# EAGLE design BaseModule (EAGLE 9.6.2)
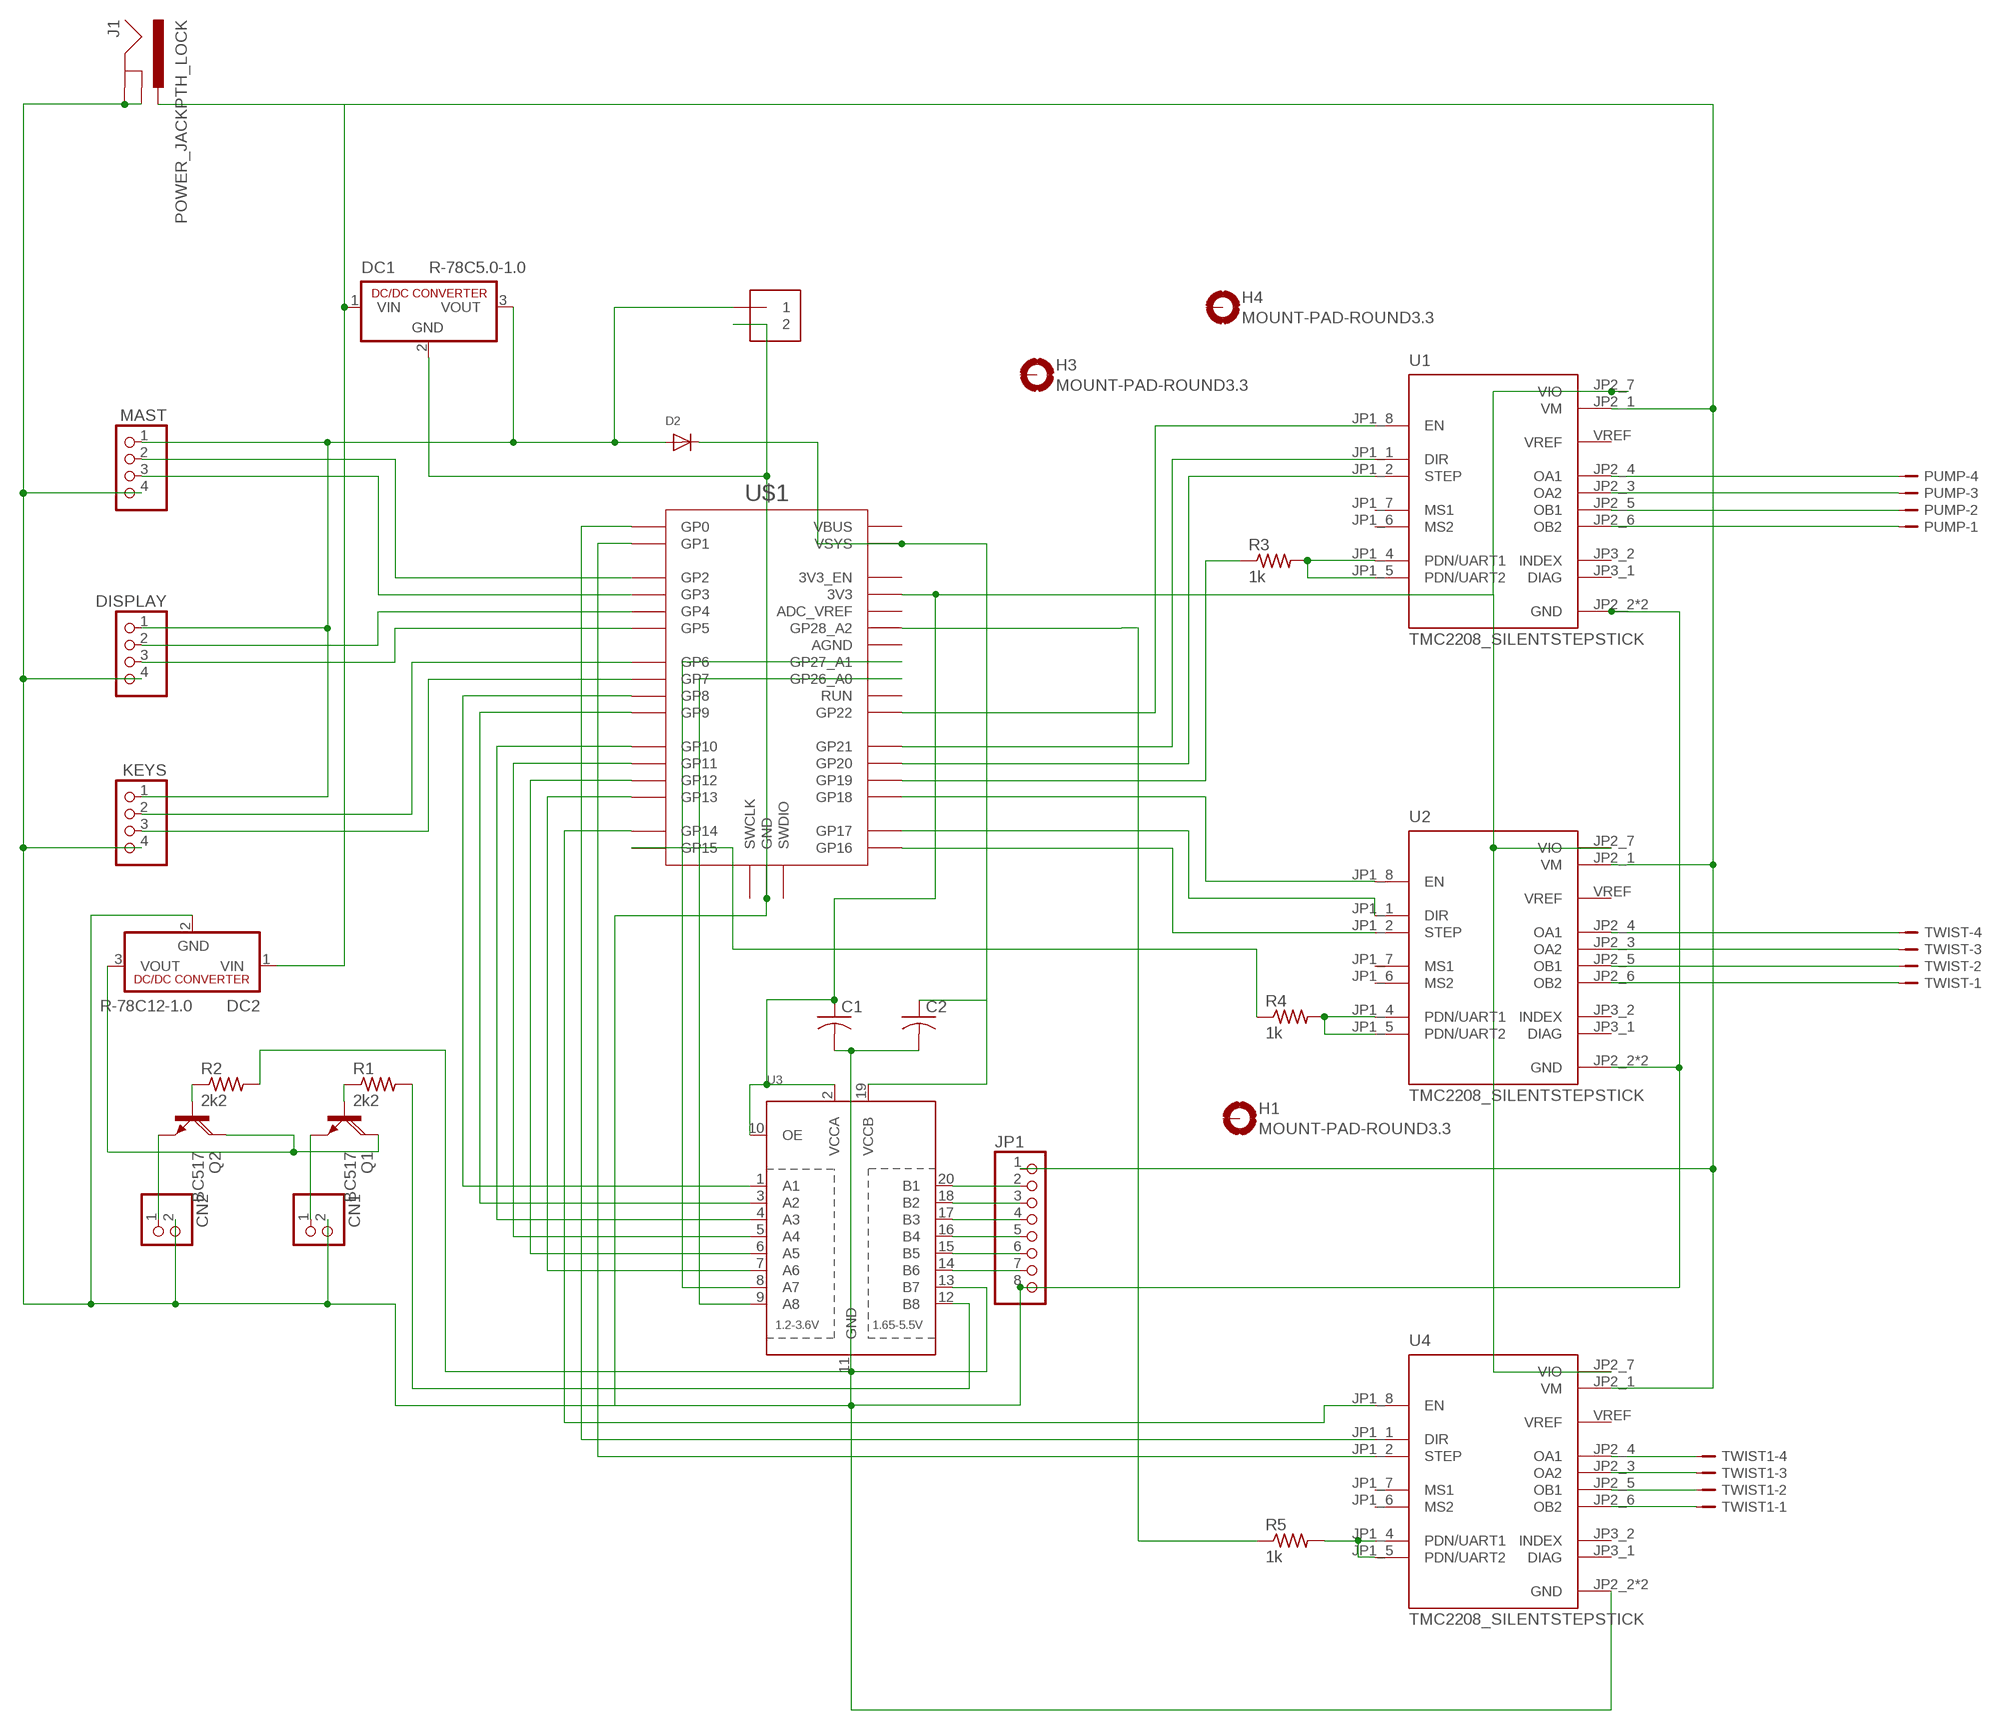
[diagram p0: schematic, sheet 1]

## Parts
C1  C-USC1206  [C1206]
C2  C-USC1206  [C1206]
CN1  JST_2PIN-THM-RA  [JST-PH-2-THM-RA]
CN2  JST_2PIN-THM-RA  [JST-PH-2-THM-RA]
D2  DIODESMA  [SMADIODE]
DC1  R-78C5.0-1.0  [SIP3]
DC2  R-78C12-1.0  [SIP3]
DISPLAY  PINHD-1X4  [1X04]
H1  MOUNT-PAD-ROUND3.3  [3,3-PAD]
H3  MOUNT-PAD-ROUND3.3  [3,3-PAD]
H4  MOUNT-PAD-ROUND3.3  [3,3-PAD]
J1  POWER_JACKPTH_LOCK  [POWER_JACK_PTH_LOCK]
J2  1X2-3.5MM  [1X2-3.5MM]
JP1  PINHD-1X8-3.5MM  [1X08-3.5MM]
KEYS  PINHD-1X4  [1X04]
MAST  PINHD-1X4  [1X04]
PUMP  JST-PH-4_TH-RA  [S4B-PH-KL]
Q1  BC517  [SOT54A]
Q2  BC517  [SOT54A]
R1  2k2  R-US_R1206  [R1206]
R2  2k2  R-US_R1206  [R1206]
R3  1k  R-US_R1206  [R1206]
R4  1k  R-US_R1206  [R1206]
R5  1k  R-US_R1206  [R1206]
TWIST  JST-PH-4_TH-RA  [S4B-PH-KL]
TWIST1  JST-PH-4_TH-RA  [S4B-PH-KL]
U1  TMC2208_SILENTSTEPSTICK  [MODULE_TMC2208_SILENTSTEPSTICK]
U2  TMC2208_SILENTSTEPSTICK  [MODULE_TMC2208_SILENTSTEPSTICK]
U3  TXB0108PWR  [TSSOP20]
U4  TMC2208_SILENTSTEPSTICK  [MODULE_TMC2208_SILENTSTEPSTICK]
U$1  RPI_PICO-TH  [RPI_PICO_TH]

## Nets
GND: C1.2 C2.2 CN1.2 CN2.2 DC1.2(GND) DC2.2(GND) DISPLAY.4 J1.GND J1.GNDBREAK J2.2 JP1.8 KEYS.4 MAST.4 U1.JP2_2(GND) U1.JP2_8(GND) U2.JP2_2(GND) U2.JP2_8(GND) U3.11(GND) U4.JP2_2(GND) U4.JP2_8(GND) U$1.GND@1(GND) U$1.GND@2(GND) U$1.GND@3(GND) U$1.GND@4(GND) U$1.GND@5(GND) U$1.GND@6(GND) U$1.GND@7(GND) U$1.GND@8(GND)
N$1: Q1.B R1.1
N$2: Q2.B R2.1
N$3: R3.2 U1.JP1_4(PDN/UART1) U1.JP1_5(PDN/UART2)
N$4: R4.2 U2.JP1_4(PDN/UART1) U2.JP1_5(PDN/UART2)
N$5: DC1.1(VIN) DC2.1(VIN) J1.PWR JP1.1 U1.JP2_1(VM) U2.JP2_1(VM) U4.JP2_1(VM)
N$6: U2.JP1_8(EN) U$1.GP18
N$7: TWIST1.4 U4.JP2_4(OA1)
N$8: C2.1 D2.C U3.19(VCCB) U$1.VSYS
N$9: U3.7(A6) U$1.GP13
N$10: CN2.1 Q2.E
N$11: JP1.2 U3.20(B1)
N$12: R4.1 U$1.GP15
N$13: D2.A DC1.3(VOUT) DISPLAY.1 J2.1 KEYS.1 MAST.1
N$14: TWIST1.3 U4.JP2_3(OA2)
N$15: TWIST.4 U2.JP2_4(OA1)
N$16: TWIST.3 U2.JP2_3(OA2)
N$17: TWIST.2 U2.JP2_5(OB1)
N$18: TWIST.1 U2.JP2_6(OB2)
N$19: PUMP.4 U1.JP2_4(OA1)
N$20: PUMP.3 U1.JP2_3(OA2)
N$21: PUMP.2 U1.JP2_5(OB1)
N$22: PUMP.1 U1.JP2_6(OB2)
N$23: U2.JP1_1(DIR) U$1.GP17
N$24: U2.JP1_2(STEP) U$1.GP16
N$25: JP1.3 U3.18(B2)
N$26: U1.JP1_8(EN) U$1.GP22
N$27: U1.JP1_1(DIR) U$1.GP21
N$28: U1.JP1_2(STEP) U$1.GP20
N$29: R3.1 U$1.GP19
N$30: MAST.2 U$1.GP2
N$31: MAST.3 U$1.GP3
N$32: DISPLAY.2 U$1.GP4
N$33: DISPLAY.3 U$1.GP5
N$34: KEYS.2 U$1.GP6
N$35: KEYS.3 U$1.GP7
N$36: CN1.1 Q1.E
N$37: JP1.4 U3.17(B3)
N$38: JP1.5 U3.16(B4)
N$39: JP1.6 U3.15(B5)
N$40: JP1.7 U3.14(B6)
N$41: U3.1(A1) U$1.GP8
N$42: TWIST1.2 U4.JP2_5(OB1)
N$43: C1.1 U1.JP2_7(VIO) U2.JP2_7(VIO) U3.2(VCCA) U3.10(OE) U4.JP2_7(VIO) U$1.3V3
N$44: R2.2 U3.13(B7)
N$45: R1.2 U3.12(B8)
N$46: U3.3(A2) U$1.GP9
N$47: U3.4(A3) U$1.GP10
N$48: U3.5(A4) U$1.GP11
N$49: U3.6(A5) U$1.GP12
N$50: DC2.3(VOUT) Q1.C Q2.C
N$51: U3.8(A7) U$1.GP27_A1
N$52: U3.9(A8) U$1.GP26_A0
N$53: TWIST1.1 U4.JP2_6(OB2)
N$54: U4.JP1_8(EN) U$1.GP14
N$55: R5.1 U$1.GP28_A2
N$56: R5.2 U4.JP1_4(PDN/UART1) U4.JP1_5(PDN/UART2)
N$57: U4.JP1_1(DIR) U$1.GP0
N$58: U4.JP1_2(STEP) U$1.GP1
Unconnected: H1.B3,3(MOUNT) H3.B3,3(MOUNT) H4.B3,3(MOUNT) U1.JP1_6(MS2) U1.JP1_7(MS1) U1.JP3_1(DIAG) U1.JP3_2(INDEX) U1.VREF U2.JP1_6(MS2) U2.JP1_7(MS1) U2.JP3_1(DIAG) U2.JP3_2(INDEX) U2.VREF U4.JP1_6(MS2) U4.JP1_7(MS1) U4.JP3_1(DIAG) U4.JP3_2(INDEX) U4.VREF U$1.3V3_EN U$1.ADC_VREF U$1.AGND U$1.RUN U$1.SWCLK U$1.SWDIO U$1.VBUS

## Library data of the parts
C1 C2 = adafruit:C-US: CAPACITOR, American symbol
CN1 CN2 = adafruit:JST_2PIN: JST 2-Pin Connectors of various flavors SMT-RA (S2B-PH-SM4) 4UConnector #17311 SMT (B2B-PH-SM4) THM-RA (S2B-PH) THM (B2B-PH)
D2 = adafruit:DIODE: Diode SMADIODE - SMA Surface Mount Package 20V 1A Schottky Diode Digikey: 641-1014-6-ND DO-1N4148 - Through Hole Small Current Diode SOD-123 20V 1 A (.5mV Vf) Schottky Diode - Digikey: MBRX120TPMSCT-ND SOD-323 10V 570mA (.38mV Vf, 3ns) Schottky Diode - Digikey: ZLLS410CT-ND SOD-523 30V 30mA Schottky Diode (RB751S-40TE61) - Digikey: RB751S-40TE61CT-ND SOT23-R/W - SOT23 Package (R = Solder Paste/Reflow Ovens, W = Hand-Soldering) BAT54Film 40V 300mA - Digikey: 497-7162-1-ND
DC1 DC2 = dc-dc-converter:R-78C*-1.0: INNOLINE DC/DC-Converter 1.0 AMP SIP3 Single Output Source: Data sheet <http://www.mikrocontroller.net/attachment/150645/157764-da-01-en-DC_DC_WANDLER_R_78C5_0_1_0.pdf>
DISPLAY KEYS MAST = pinhead:PINHD-1X4: PIN HEADER
H1 H3 H4 = holes:MOUNT-PAD-ROUND: MOUNTING PAD, round
J1 = SparkFun-Connectors:POWER_JACK: Power Jack Connector This is the standard 5.5mm barrel jack for power. The PTH is the most common, proven, reliable, footprint. The Slot footprint only works if the mill layer is transmitted to the PCB fab house so be warned. Here are the connectors we sell at SparkFun: DC Barrel Power Jack/Connector <https://www.sparkfun.com/products/119> (PRT-00119) DC Barrel Power Jack/Connector (SMD) <https://www.sparkfun.com/products/12748> (PRT-12748) DC Barrel Jack Adapter - Breadboard Compatible <https://www.sparkfun.com/products/10811> (PRT-10811) It is used on this SparkFun product (and many, many others): SparkFun RedBoard - Programmed with Arduino <https://www.sparkfun.com/products/12757> (DEV-12757) Also, if you need a mating power supply or connector, please check these out: Wall Adapter Power Supply - 9VDC 650mA <https://www.sparkfun.com/products/298> (TOL-00298) DC Barrel Jack Adapter - Male <https://www.sparkfun.com/products/10287> (PRT-10287); PROD_ID: CONN-08197; SF_ID: PRT-00119
J2 = adafruit:1X2: 3.5mm Terminal block http://www.ladyada.net/library/pcb/eaglelibrary.html
JP1 = adafruit:PINHD-1X8: PIN HEADER
PUMP TWIST TWIST1 = con-JST-PH:JST-PH-4; MF: JST; MPN: S4B-PH-KL
Q1 Q2 = transistor-small-signal:BC517: NPN DARLINGTON TRANSISTOR
R1-R5 = adafruit:R-US_: RESISTOR, American symbol
U1 U2 U4 = TMC2208_SILENTSTEPSTICK:TMC2208_SILENTSTEPSTICK: Check availability <https://pricing.snapeda.com/parts/TMC2208%20SILENTSTEPSTICK/Trinamic%20Motion/view-part?ref=eda>; AVAILABILITY: In Stock; CHECK_PRICES: https://www.snapeda.com/parts/TMC2208%20SILENTSTEPSTICK/Trinamic/view-part/?ref=eda; DESCRIPTION: TMC2208 Motor Controller/Driver, Stepper Power Management Evaluation Board; MF: Trinamic Motion; MP: TMC2208 SILENTSTEPSTICK; PACKAGE: None; PRICE: None; SNAPEDA_LINK: https://www.snapeda.com/parts/TMC2208%20SILENTSTEPSTICK/Trinamic/view-part/?ref=snap
U3 = adafruit:TXB0108PWR: 8-Bit Bi-Directional Level Shifter 1.2V-3.6V (VCCA) to 1.65V-5.5V (VCCB) bi-directional level shifter with auto direction sensing. Max data rate - VCCA 1.8V: 20Mbps (50ns), VCCA 3.3V: 100Mbps (10ns) Digikey: 296-21527-1-ND
U$1 = RaspberryPi_Pico:RPI_PICO

## Board
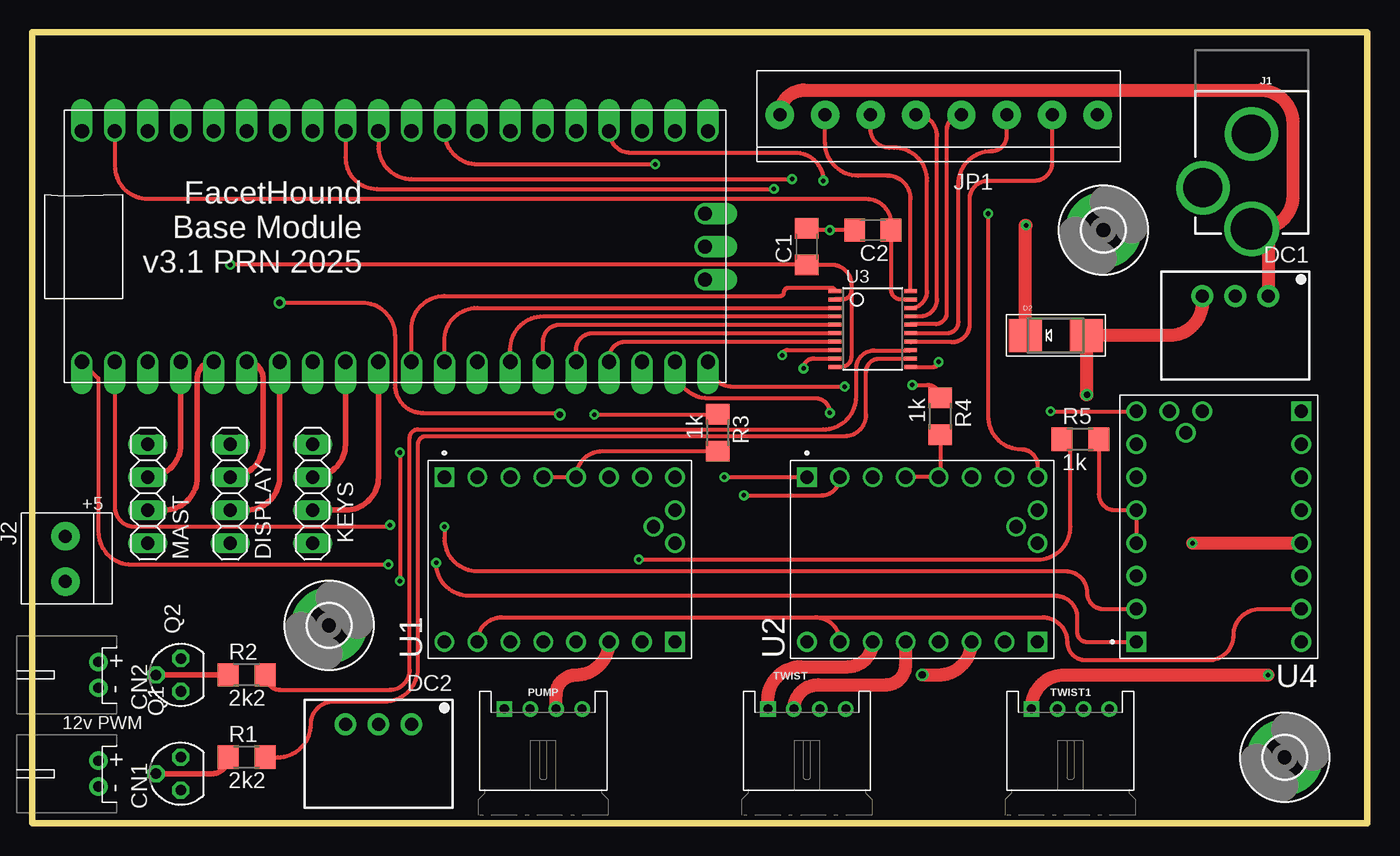
[diagram p1: board, top side]
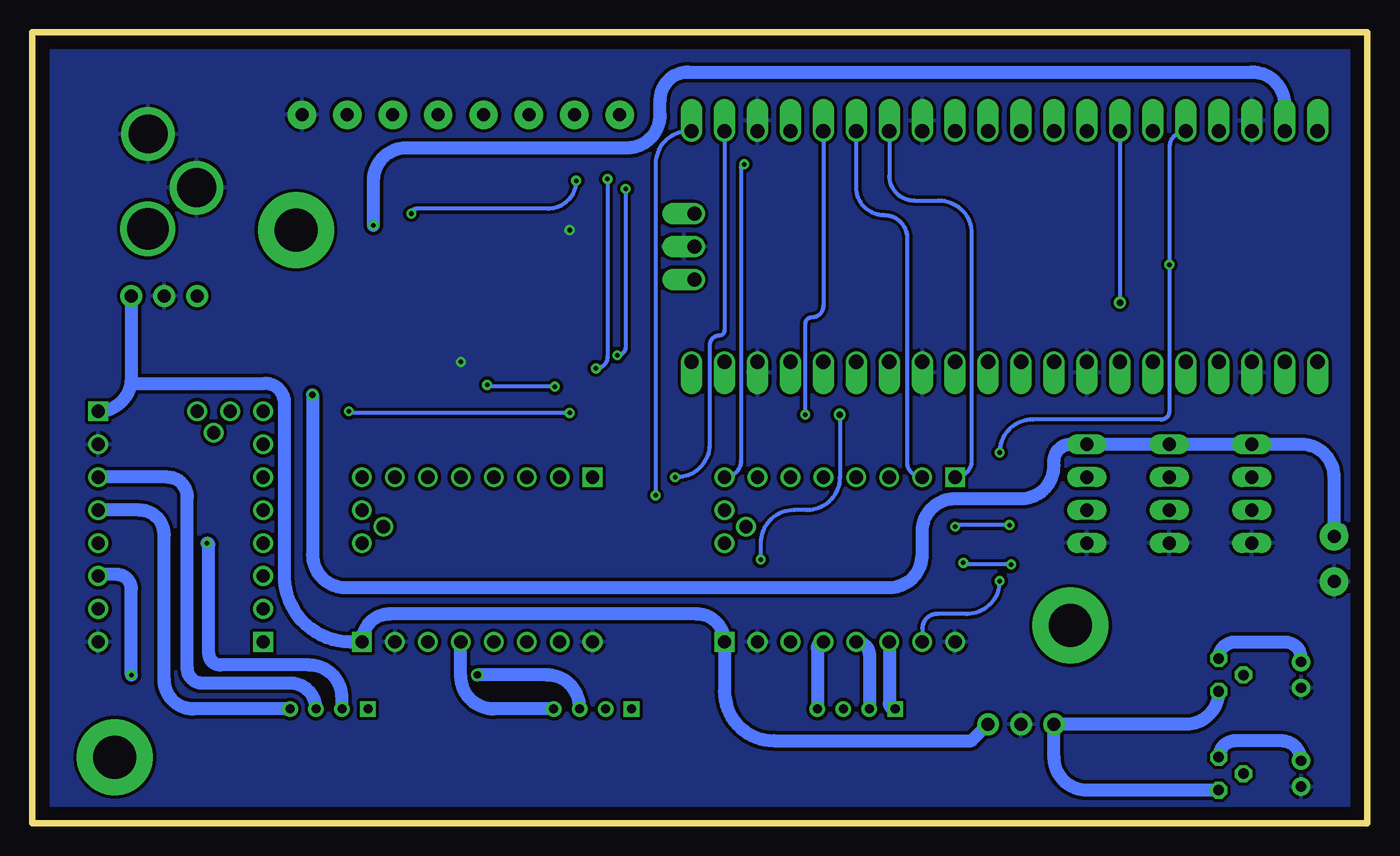
[diagram p2: board, bottom side, seen from below]

Size 102.87 x 60.96 mm. Coordinates in mm from the lower left corner, seen from the top.
Outline: 0,0 0,60.96 102.87,60.96 102.87,0 0,0
Copper layers (1*16): Top 0.035mm / dielectric 1.5mm / Bottom 0.035mm
Design rules "default": minimum track width 6mil, minimum drill 0.35mm, track to track 6mil, track to pad 6mil, pad to pad 6mil, via to via 6mil, smd to smd 6mil, copper to edge 40mil, drill to drill 6mil, minimum pad ring 10mil, minimum via ring 8mil, stop-mask expansion 4mil, vias tented up to drill 0mil, thermal gap 10mil

### Footprints (pad centres in the part's own frame; a part is rotated, then mirrored left to right if it is on the bottom)
C1206 = smd 1.6 x 1.8: 1 -1.4,0; 2 1.4,0
JST-PH-2-THM-RA = drill 0.8 pad 1.422: 1 1,0; 2 -1,0
SMADIODE = smd 2.54 x 2.54: A 2.349,0; C -2.349,0
SIP3 = drill 1 pad 1.676: 1 -2.54,0; 2 0,0; 3 2.54,0
1X04 = drill 1.016 long: 1 -3.81,0; 2 -1.27,0; 3 1.27,0; 4 3.81,0
3,3-PAD = drill 3.3 pad 5.842: B3,3 0,0
POWER_JACK_PTH_LOCK = drill 2.997 pad 4.115: GND 0.025,6.557; GNDBREAK 3.762,10.7 | drill 3.2 pad 4.115: PWR 0,13.878
1X2-3.5MM = drill 1 pad 2.184: 1 1.8,0; 2 -1.7,0
1X08-3.5MM = drill 1 pad 2.184: 1 -12.25,0; 2 -8.75,0; 3 -5.25,0; 4 -1.75,0; 5 1.75,0; 6 5.25,0; 7 8.75,0; 8 12.25,0
S4B-PH-KL = drill 0.7 square: 1 3,-3.72 | drill 0.7: 2 1,-3.72; 3 -1,-3.72; 4 -3,-3.72
SOT54A = drill 0.813 octagon: B 0,1.905; C -1.27,0; E 1.27,0
R1206 = smd 1.6 x 1.803: 1 -1.422,0; 2 1.422,0
MODULE_TMC2208_SILENTSTEPSTICK = drill 1.016 square: JP1_1 6.35,8.89; JP2_1 -6.35,-8.89 | drill 1.016: JP1_2 6.35,6.35; JP1_3 6.35,3.81; JP1_4 6.35,1.27; JP1_5 6.35,-1.27; JP1_6 6.35,-3.81; JP1_7 6.35,-6.35; JP1_8 6.35,-8.89; JP2_2 -6.35,-6.35; JP2_3 -6.35,-3.81; JP2_4 -6.35,-1.27; JP2_5 -6.35,1.27; JP2_6 -6.35,3.81; JP2_7 -6.35,6.35; JP2_8 -6.35,8.89; JP3_1 1.27,-8.89; JP3_2 3.81,-8.89; VREF 2.54,-7.239
TSSOP20 = smd 0.305 x 0.991: 1 -2.925,-2.918; 2 -2.275,-2.918; 3 -1.625,-2.918; 4 -0.975,-2.918; 5 -0.325,-2.918; 6 0.325,-2.918; 7 0.975,-2.918; 8 1.625,-2.918; 9 2.275,-2.918; 10 2.925,-2.918; 11 2.925,2.918; 12 2.275,2.918; 13 1.625,2.918; 14 0.975,2.918; 15 0.325,2.918; 16 -0.325,2.918; 17 -0.975,2.918; 18 -1.625,2.918; 19 -2.275,2.918; 20 -2.925,2.918
RPI_PICO_TH = drill 1.1 pad 1.6 offset: 3V3 8.89,13.97; 3V3_EN 8.89,16.51; ADC_VREF 8.89,11.43; AGND 8.89,6.35; GND@1 -8.89,19.05; GND@2 -8.89,6.35; GND@3 -8.89,-6.35; GND@4 -8.89,-19.05; GND@5 0,-23.9; GND@6 8.89,-19.05; GND@7 8.89,-6.35; GND@8 8.89,19.05; GP0 -8.89,24.13; GP1 -8.89,21.59; GP2 -8.89,16.51; GP3 -8.89,13.97; GP4 -8.89,11.43; GP5 -8.89,8.89; GP6 -8.89,3.81; GP7 -8.89,1.27; GP8 -8.89,-1.27; GP9 -8.89,-3.81; GP10 -8.89,-8.89; GP11 -8.89,-11.43; GP12 -8.89,-13.97; GP13 -8.89,-16.51; GP14 -8.89,-21.59; GP15 -8.89,-24.13; GP16 8.89,-24.13; GP17 8.89,-21.59; GP18 8.89,-16.51; GP19 8.89,-13.97; GP20 8.89,-11.43; GP21 8.89,-8.89; GP22 8.89,-3.81; GP26_A0 8.89,1.27; GP27_A1 8.89,3.81; GP28_A2 8.89,8.89; RUN 8.89,-1.27; SWCLK -2.54,-23.9; SWDIO 2.54,-23.9; VBUS 8.89,24.13; VSYS 8.89,21.59

### Placement (x,y rotation side)
C1  59.69,44.45 90 top
C2  64.77,45.72 180 top
CN1  5.08,3.81 90 top
CN2  5.08,11.43 90 top
D2  78.87,37.59 0 top
DC1  92.71,40.64 180 top
DC2  26.67,7.62 180 top
DISPLAY  15.24,25.4 270 top
H1  82.55,45.72 0 top
H3  96.52,5.08 0 top
H4  22.86,15.24 0 top
J1  93.98,59.69 180 top
J2  2.54,20.32 90 top
JP1  69.85,54.61 0 top
KEYS  21.59,25.4 270 top
MAST  8.89,25.4 270 top
PUMP  39.37,5.08 180 top
Q1  11.43,3.81 90 top
Q2  11.43,11.43 90 top
R1  16.51,5.08 0 top
R2  16.51,11.43 0 top
R3  52.83,30.1 270 top
R4  69.98,31.37 270 top
R5  80.77,29.59 0 top
TWIST  59.69,5.08 180 top
TWIST1  80.01,5.08 180 top
U1  40.64,20.32 90 top
U2  68.58,20.32 90 top
U3  64.77,38.1 270 top
U4  91.44,22.86 180 top
U$1  27.94,44.45 90 top

### Tracks (layer width: path | path; a pad name or v marks a point on that pad's centre or on a via)
GND  (via drill 0.35)
  Top 0.305: C2.2 v61.47,45.72 59.82,45.72 arc-90 C1.2 | U3.11 69.46,35.17 arc90 v69.85,35.56
  pour Bottom (isolate 0.254): 1.27,59.69 1.27,1.27 101.6,1.27 101.6,59.69
N$1
  Top 0.406: Q1.B 13.82,3.81 arc90 R1.1
N$2
  Top 0.406: R2.1 Q2.B
N$3
  Top 0.305: R3.2 43.92,28.68 arc90 U1.JP1_5 U1.JP1_4
N$4
  Top 0.305: 69.85,29.87 arc-90 69.95,29.97 arc-90 R4.2 69.98,26.8 arc-90 U2.JP1_5 U2.JP1_4
N$5
  Top 1.016: DC1.1 95.25,44.54 arc90 J1.PWR 94.61,45.81 arc90 97.16,48.35 97.16,53.98 arc90 94.61,56.52 59.51,56.52 arc90 JP1.1
  Bottom 1.016: DC2.1 30.48,6.35 45.72,6.35 arc90 49.53,10.16 U1.JP2_1 arc-90 51.69,16.13 75.31,16.13 arc-90 U2.JP2_1 78.36,13.97 arc90 83.44,19.05 83.44,32.38 arc-90 84.96,33.91 95.25,33.91 95.25,34.29 | DC1.1 95.25,34.92 95.25,34.29 | 95.25,34.29 arc90 U4.JP2_1
N$6  (via drill 0.35)
  Top 0.305: 44.32,53.47 arc90 U$1.GP18 arc90 46.1,51.69 58.8,51.69 arc-90 v60.96,49.53 | v73.66,46.99 73.66,31.37 arc90 76.2,28.83 arc-90 77.47,27.56 U2.JP1_8
  Bottom 0.305: v60.96,49.53 arc90 63.12,47.37 73.28,47.37 arc-90 v73.66,46.99
N$7
  Bottom 1.016: TWIST1.4 90.46,8.8 arc90 92.71,11.05 92.71,22.23 arc-90 94.61,24.13 U4.JP2_4
N$8  (via drill 0.35)
  Top 0.305: U3.19 arc90 67.68,40.39 66.93,40.39 arc-90 66.17,41.15 C2.1 66.17,46.23 arc90 64.26,48.13 8.89,48.13 arc-90 6.35,50.67 U$1.VSYS
  Top 0.61: U$1.VSYS 6.35,54.61
  Top 1.016: D2.C 76.52,46.04 arc-90 v76.58,46.1
  Bottom 1.016: v76.58,46.1 76.58,49.53 arc90 74.04,52.07 57.02,52.07 arc-90 54.48,54.61 54.48,55.75 arc90 52.32,57.91 8.89,57.91 arc90 6.35,55.37 U$1.VSYS
N$9
  Top 0.305: U$1.GP13 44.45,35.85 arc-90 45.72,37.12 U3.7
N$10
  Bottom 1.016: Q2.E arc90 10.16,13.97 6.35,13.97 arc90 5.08,12.7 CN2.1
N$11
  Top 0.305: U3.20 67.69,48.14 arc90 65.91,49.91 63.64,49.91 arc-90 61.1,52.45 JP1.2
N$12  (via drill 0.35)
  Top 0.305: U$1.GP15 arc90 53.98,33.66 v62.61,33.66 | v67.82,33.78 68.99,33.78 arc-90 R4.1
  Bottom 0.305: v62.61,33.66 67.69,33.66 arc90 v67.82,33.78
N$13  (via drill 0.5)
  Top 1.016: DC1.3 90.17,40.13 arc-90 87.63,37.59 D2.A 81.22,33.08 arc90 v81.28,33.02
  Bottom 1.016: 2.03,22.63 J2.1 2.54,26.67 arc-90 5.08,29.21 MAST.1 DISPLAY.1 KEYS.1 22.86,29.21 arc-90 24.13,27.94 24.13,27.56 arc90 26.67,25.02 31.75,25.02 arc-90 34.29,22.48 34.29,20.7 arc90 36.83,18.16 78.74,18.16 arc90 81.28,20.7 v81.28,33.02
N$14
  Bottom 1.016: TWIST1.3 arc-90 83,10.79 89.79,10.79 arc90 90.93,11.94 90.93,25.15 arc-90 92.46,26.67 U4.JP2_3
N$15
  Bottom 1.016: TWIST.4 67.31,8.8 arc90 69.85,11.34 U2.JP2_4
N$16  (via drill 0.55)
  Top 1.016: v68.58,11.43 69.85,11.43 arc90 U2.JP2_3
  Bottom 1.016: TWIST.3 60.69,8.89 arc-90 63.23,11.43 v68.58,11.43
N$17
  Top 1.016: TWIST.2 arc-90 60.56,10.67 65.79,10.67 arc90 67.31,12.19 U2.JP2_5
N$18
  Top 1.016: TWIST.1 56.69,9.53 arc-90 59.23,12.06 62.87,12.06 arc90 U2.JP2_6
N$19
  Bottom 1.016: U1.JP2_4 arc-90 42.37,13.51 PUMP.4
N$20
  Top 1.016: PUMP.3 40.37,9.89 arc-90 41.91,11.43 arc90 U1.JP2_3
N$21
  Bottom 1.016: U1.JP2_5 arc90 38.35,12.95 38.35,8.82 arc90 PUMP.2
N$22
  Bottom 1.016: U1.JP2_6 36.83,9.26 arc-90 PUMP.1
N$23  (via drill 0.35)
  Top 0.305: v53.34,26.67 U2.JP1_1
  Bottom 0.305: U$1.GP17 49.53,37.97 arc90 49.91,37.59 arc-90 50.67,36.83 50.67,29.21 arc90 53.21,26.67 v53.34,26.67
N$24  (via drill 0.35)
  Top 0.305: v54.84,25.27 60.83,25.27 arc90 U2.JP1_2
  Bottom 0.305: U$1.GP16 52.3,53.34 arc-90 54.84,50.8 v54.84,25.27
N$25
  Top 0.305: U3.18 arc90 68.96,41 68.96,49.53 arc90 66.42,52.07 66.04,52.07 arc-90 64.6,53.51 JP1.3
N$26  (via drill 0.35)
  Top 0.305: U$1.GP22 arc90 34.29,50.8 v48.01,50.8
  Bottom 0.305: v48.01,50.8 arc-90 48.26,50.55 48.26,27.94 arc90 U1.JP1_8
N$27
  Bottom 0.305: U$1.GP21 36.83,49.91 arc-90 34.93,48.01 33.02,48.01 arc90 30.48,45.47 30.48,27.94 arc90 U1.JP1_1
N$28
  Bottom 0.305: U1.JP1_2 arc90 35.43,27.81 35.43,45.09 arc-90 37.21,46.86 arc90 39.37,49.02 U$1.GP20 39.37,54.61
N$29  (via drill 0.35)
  Top 0.305: v43.31,31.5 52.81,31.5 arc90 R3.1
  Bottom 0.305: U$1.GP19 41.91,39.88 arc90 42.8,38.99 arc-90 43.31,38.48 v43.31,31.5
N$30
  Top 0.406: MAST.2 arc90 11.43,29.21 U$1.GP2
N$31
  Top 0.406: MAST.3 10.16,24.13 arc90 12.7,26.67 12.7,34.29 arc-90 U$1.GP3
N$32
  Top 0.406: DISPLAY.2 arc90 17.78,29.21 17.78,34.29 arc90 U$1.GP4
N$33
  Top 0.406: DISPLAY.3 16.51,24.13 arc90 19.05,26.67 U$1.GP5
N$34
  Top 0.406: KEYS.2 arc90 24.13,29.21 U$1.GP6
N$35
  Top 0.406: KEYS.3 24.13,24.13 arc90 26.67,26.67 U$1.GP7
N$36
  Bottom 1.016: CN1.1 arc-90 6.62,6.35 10.16,6.35 arc-90 Q1.E
N$37
  Top 0.305: U3.17 68.41,39.08 arc90 69.72,40.39 69.72,52.99 arc90 JP1.4
N$38
  Top 0.305: U3.16 arc-90 67.74,38.48 69.6,38.48 arc90 70.48,39.37 70.48,53.44 arc-90 71.63,54.58 arc90 JP1.5
N$39
  Top 0.305: U3.15 70.48,37.77 arc90 71.37,38.66 71.37,49.28 arc-90 73.91,51.82 arc90 75.1,53 JP1.6 arc90 74.93,54.44
N$40
  Top 0.305: U3.14 arc90 67.73,37.08 70.87,37.08 arc90 72.25,38.47 72.25,48.12 arc-90 73.66,49.53 77.22,49.53 arc90 78.61,50.93 78.61,54.6 arc90 JP1.7
N$41
  Top 0.305: U$1.GP8 29.21,38.1 arc-90 31.75,40.64 57.66,40.64 arc90 57.91,40.89 arc-90 58.29,41.27 61.6,41.27 arc-90 U3.1
N$42  (via drill 0.35)
  Top 1.016: v89.41,21.59 U4.JP2_5
  Bottom 1.016: TWIST1.2 79.01,9.65 arc-90 81.55,12.19 88.39,12.19 arc90 89.28,13.08 89.28,21.46 arc-90 v89.41,21.59
N$43  (via drill 0.35)
  Top 0.305: 63.12,41.02 63.12,41.53 arc90 61.6,43.05 C1.1 v15.24,43.05 arc-90 v15.24,43.05 | 63.12,41.02 arc-90 62.48,40.39 61.86,40.39 arc90 U3.2 | 63.12,41.02 63.12,35.94 arc-90 62.35,35.17 U3.10 | U1.JP2_7 arc-90 36.2,15.88 60.33,15.88 | 60.33,15.88 arc-90 U2.JP2_7 | v28.32,28.57 v28.32,18.67 | 60.33,15.88 77.85,15.88 arc-90 79.76,13.97 arc90 81.15,12.57 90.68,12.57 arc90 92.58,14.48 arc-90 94.61,16.51 U4.JP2_7
  Bottom 0.305: U$1.3V3 arc-90 15.24,52.07 v15.24,43.05 15.24,31.75 arc90 15.88,31.11 25.78,31.11 arc-90 v28.32,28.57 | v28.32,18.67 arc90 30.86,16.13 33.15,16.13 arc-90 34.29,14.99 U1.JP2_7
N$44
  Top 0.305: R2.2 arc90 19.07,10.29 27.56,10.29 arc90 29.08,11.81 29.08,29.72 arc-90 29.72,30.35 60.96,30.35 arc90 63.5,32.89 63.5,35.05 arc-90 64.9,36.45 67.66,36.45 arc90 U3.13
N$45
  Top 0.305: R1.2 18.92,5.08 arc90 21.46,7.62 arc-90 23.24,9.4 27.18,9.4 arc90 29.72,11.94 29.72,29.21 arc-90 30.35,29.84 62.61,29.84 arc90 64.26,31.5 64.26,34.8 arc-90 65.28,35.81 67.68,35.81 arc90 U3.12
N$46
  Top 0.305: U$1.GP9 31.75,37.19 arc-90 34.29,39.73 U3.3
N$47
  Top 0.305: U$1.GP10 36.83,36.53 arc-90 39.37,39.08 U3.4
N$48
  Top 0.305: U$1.GP11 39.37,37.16 arc-90 40.64,38.42 U3.5
N$49
  Top 0.305: U$1.GP12 41.91,36.51 arc-90 43.18,37.77 U3.6
N$50
  Bottom 1.016: Q1.C 21.59,2.54 arc90 24.13,5.08 DC2.3 13.97,7.62 arc-90 Q2.C
N$51  (via drill 0.35)
  Top 0.305: U$1.GP27_A1 24.13,51.31 arc90 26.54,48.9 v57.15,48.9 | v57.79,36.07 arc-90 58.19,36.48 U3.8
  Bottom 0.305: v57.15,48.9 57.15,36.7 arc90 v57.79,36.07
N$52  (via drill 0.35)
  Top 0.305: U$1.GP26_A0 26.67,52.2 arc90 29.21,49.66 v58.55,49.66 | v59.44,35.05 arc-90 60.21,35.83 U3.9
  Bottom 0.305: v58.55,49.66 58.55,35.94 arc90 v59.44,35.05
N$53  (via drill 0.35)
  Top 1.016: TWIST1.1 77.01,8.89 arc-90 79.55,11.43 v95.25,11.43
  Bottom 1.016: v95.25,11.43 95.25,18.03 arc-90 96.39,19.18 97.66,19.18 arc-90 U4.JP2_6
N$54  (via drill 0.35)
  Top 0.305: U$1.GP14 49.53,35.31 arc90 52.07,32.77 60.33,32.77 arc-90 v61.47,31.62 | v78.49,31.75 U4.JP1_8
  Bottom 0.305: v61.47,31.62 78.36,31.62 arc90 v78.49,31.75
N$55  (via drill 0.35, 0.5)
  Top 0.305: v46.74,20.32 77.47,20.32 arc90 80.01,22.86 80.01,28.93 arc90 R5.1 | v19.05,40.13 25.4,40.13 arc-90 27.94,37.59 27.94,33.78 arc90 30.1,31.62 40.51,31.62 arc-90 v40.64,31.5
  Bottom 0.305: v46.74,20.32 46.74,21.59 arc90 44.2,24.13 43.18,24.13 arc-90 40.64,26.67 v40.64,31.5 | v19.05,40.13 U$1.GP28_A2 19.05,54.61
N$56
  Top 0.305: U4.JP1_4 U4.JP1_5 83.44,24.13 arc-90 82.19,25.38 R5.2
N$57  (via drill 0.35)
  Top 0.305: U$1.GP0 5.08,34.29 5.08,22.48 arc90 7.62,19.94 v27.43,19.94 | U4.JP1_1 81.28,13.97 arc-90 80.52,14.73 80.52,15.88 arc90 78.87,17.53 33.66,17.53 arc-90 v31.11,20.07
  Bottom 0.305: v27.43,19.94 30.99,19.94 arc90 v31.11,20.07
N$58  (via drill 0.35)
  Top 0.305: U$1.GP1 6.35,24.38 arc90 7.87,22.86 27.43,22.86 arc90 v27.56,22.99 | v31.75,22.86 31.75,21.97 arc90 34.29,19.43 79.63,19.43 arc-90 81.28,17.78 arc90 82.55,16.51 U4.JP1_2
  Bottom 0.305: v27.56,22.99 31.62,22.99 arc-90 v31.75,22.86

### Text on the board
tPlace: FacetHound / Base Module / v3.1 PRN 2025
tNames: +5 | 12v PWM